# Altium schematic sheet GSM_Module.SchDoc
size A
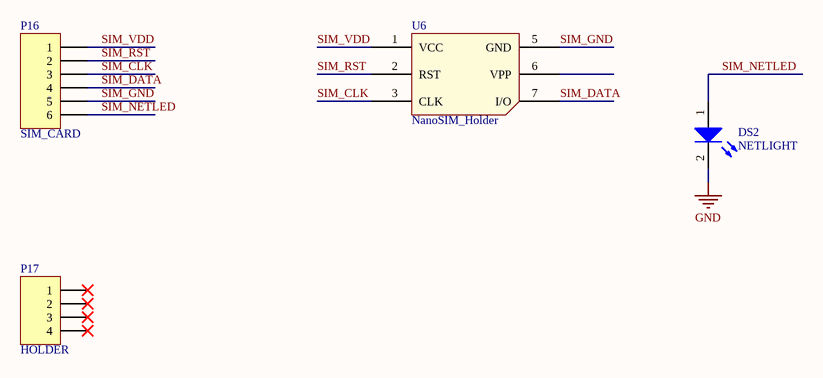
[diagram p0: GSM_Module.SchDoc]

## Parts
DS2  NETLIGHT  [0805_LED]
P16  SIM_CARD  [HDR1X6]
P17  HOLDER  [HDR1X4]
U6  NanoSIM_Holder  [Nano_SIMCard_Holder]

## Nets
GND: DS2.2(K)
SIM_CLK: P16.3 U6.3(CLK)
SIM_DATA: P16.4 U6.7(I/O)
SIM_GND: P16.5 U6.5(GND)
SIM_NETLED: DS2.1(A) P16.6
SIM_RST: P16.2 U6.2(RST)
SIM_VDD: P16.1 U6.1(VCC)

Not connected (* = marked no-connect by the designer): P17 1* 2* 3* 4*; U6 6(VPP)

## Library data of the parts
DS2 = LED0: LED 5mm Diameter; Published: 8-Jun-2000; LatestRevisionDate: 08-Jul-2005; LatestRevisionNote: Mech Layer 1 removed.; PackageReference: LED-0; Publisher: Altium Limited; PackageDescription: LED; 2 Leads
P16 = Header 6: Header, 6-Pin; LatestRevisionDate: 17-Jul-2002; LatestRevisionNote: Re-released for DXP Platform.; Publisher: Altium Limited
P17 = Header 4: Header, 4-Pin; LatestRevisionDate: 17-Jul-2002; LatestRevisionNote: Re-released for DXP Platform.; Publisher: Altium Limited